# EAGLE schematic rb03 (EAGLE 7.3.0)
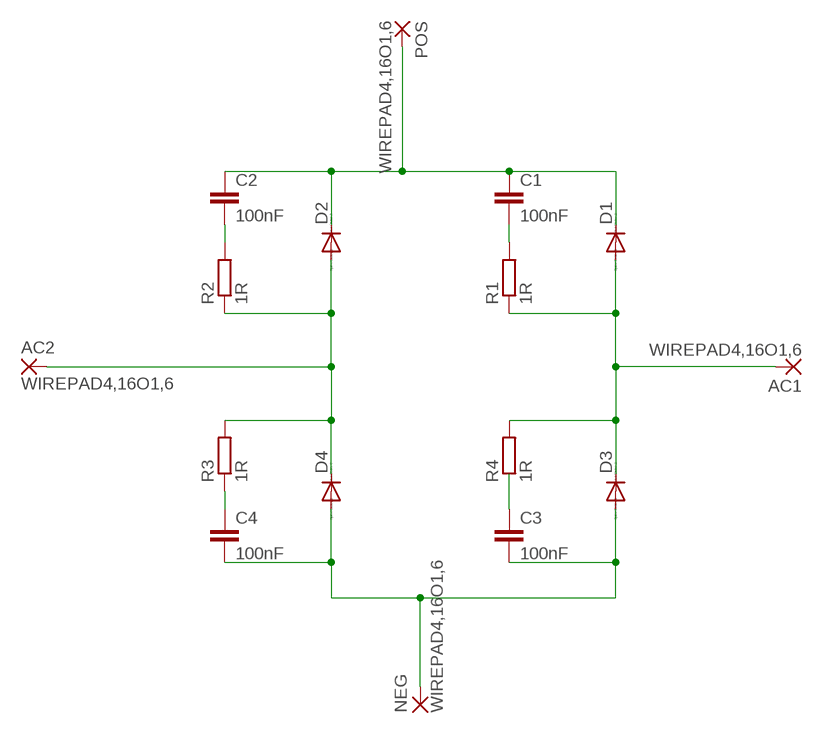
[diagram p0: schematic, sheet 1]

## Parts
AC1  WIREPAD4,16O1,6  [4,16O1,6]
AC2  WIREPAD4,16O1,6  [4,16O1,6]
C1  100nF  C-EU150-084X183  [C150-084X183]
C2  100nF  C-EU150-084X183  [C150-084X183]
C3  100nF  C-EU150-084X183  [C150-084X183]
C4  100nF  C-EU150-084X183  [C150-084X183]
D1  DIODE-TO220V  [TO220ACS]
D2  DIODE-TO220V  [TO220ACS]
D3  DIODE-TO220V  [TO220ACS]
D4  DIODE-TO220V  [TO220ACS]
NEG  WIREPAD4,16O1,6  [4,16O1,6]
POS  WIREPAD4,16O1,6  [4,16O1,6]
R1  1R  R-EU_0207/10  [0207/10]
R2  1R  R-EU_0207/10  [0207/10]
R3  1R  R-EU_0207/10  [0207/10]
R4  1R  R-EU_0207/10  [0207/10]

## Nets
N$1: AC2.1(P) D2.A D4.C R2.1 R3.2
N$2: C4.1 R3.1
N$3: C3.2 C4.2 D3.A D4.A NEG.1(P)
N$4: C3.1
N$5: AC1.1(P) D1.A D3.C R1.1 R4.2
N$6: C1.2 R1.2
N$8: C1.1 C2.1 D1.C D2.C POS.1(P)
N$9: C2.2 R2.2
Unconnected: R4.1

## Library data of the parts
AC1 AC2 NEG POS = wirepad:WIREPAD: Wire PAD connect wire on PCB
C1-C4 = resistor:C-EU: CAPACITOR, European symbol
D1-D4 = diode:DIODE-: DIODE
R1-R4 = resistor:R-EU_: RESISTOR, European symbol